# Altium schematic sheet Sheet_1_2022-10-20.schdoc
size 436 x 212 mm
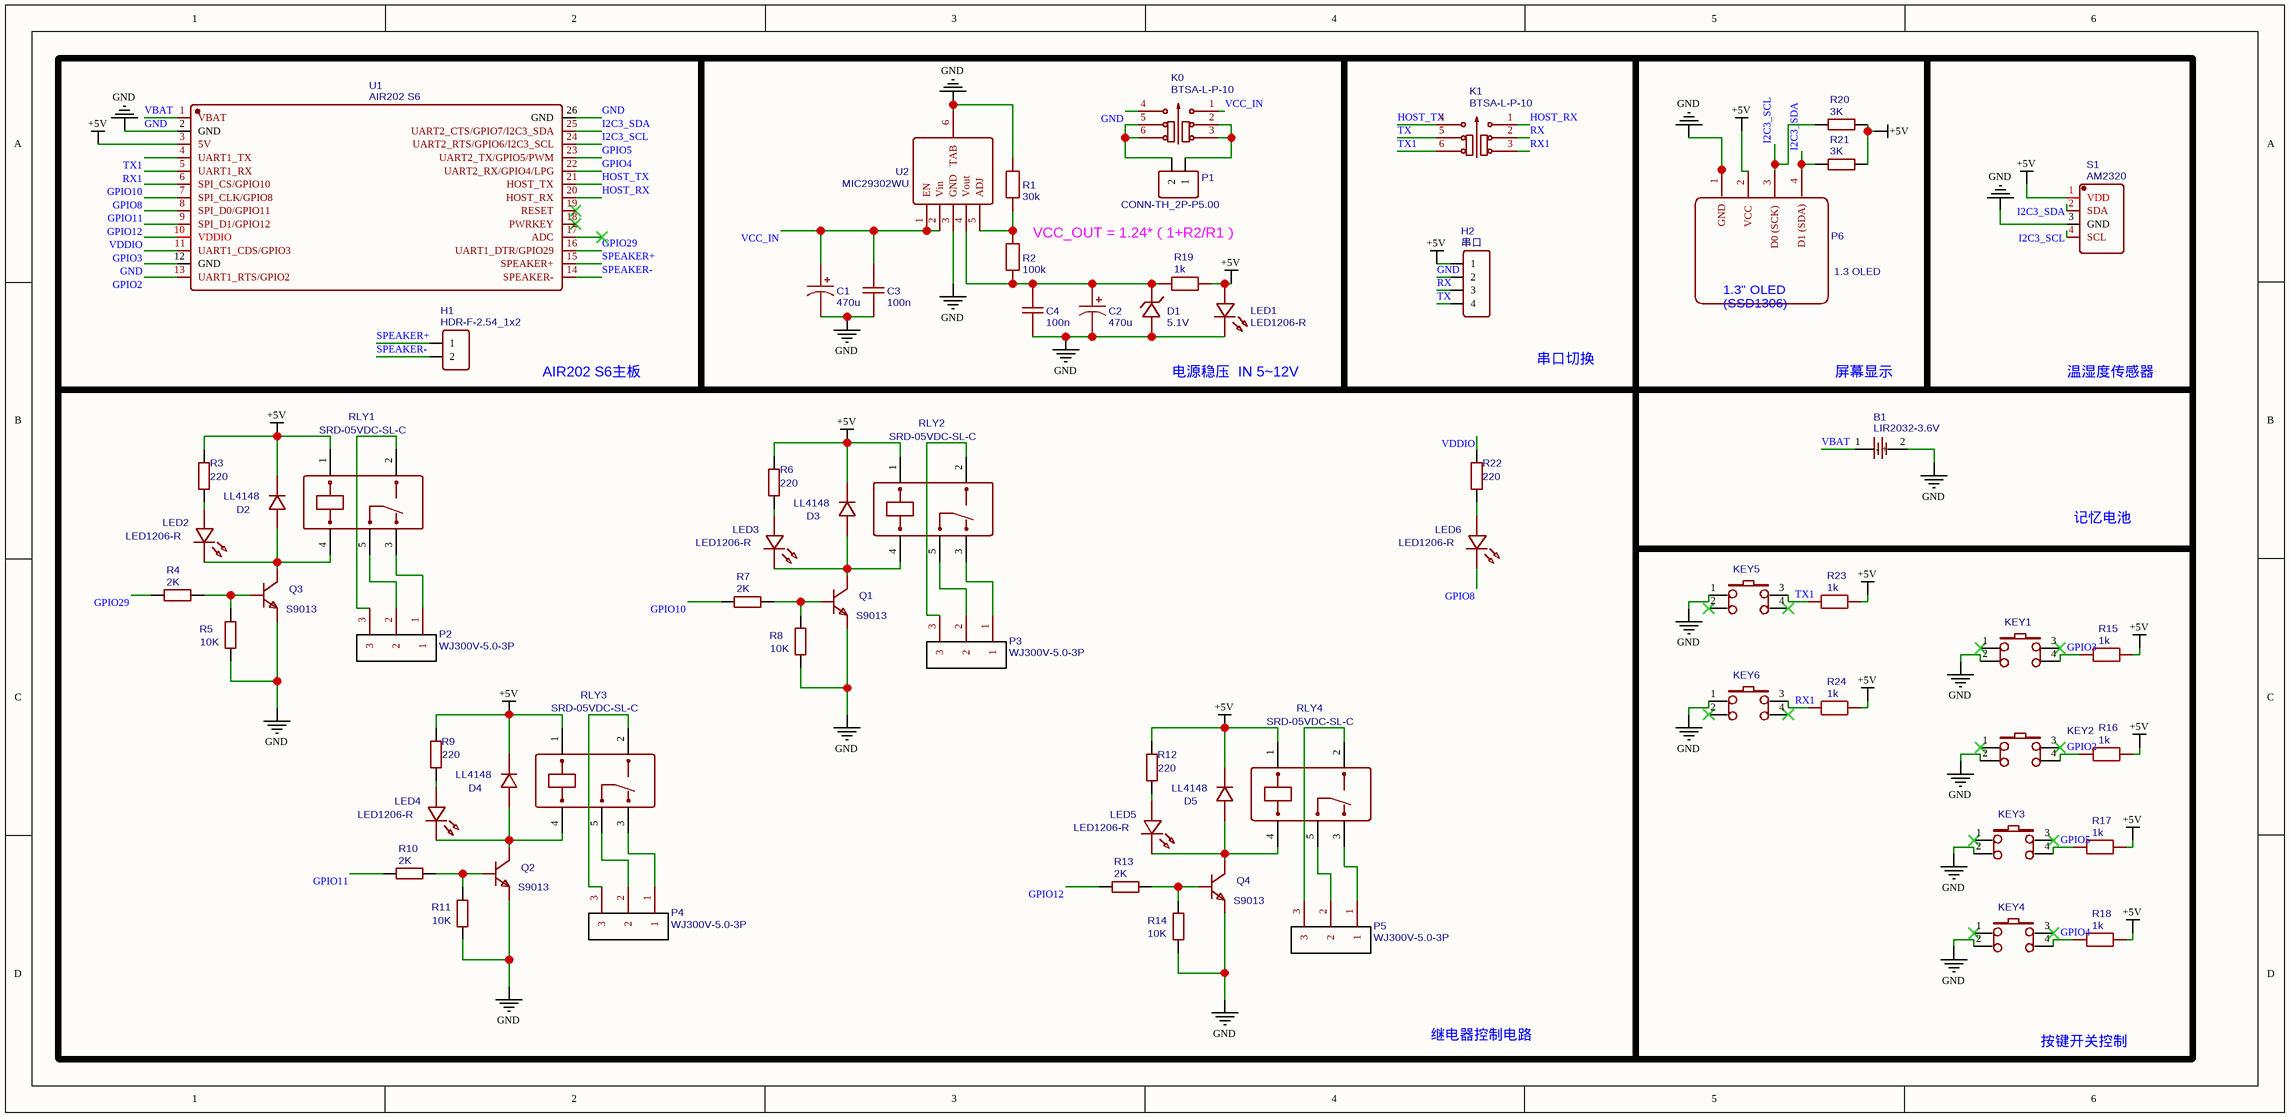
[diagram p0: Sheet_1_2022-10-20.schdoc]

## Parts
B1  LIR2032-3.6V  [LIR2032-3.6V]
C1  470u  [CAP-SMD_BD8.0-L8.3-W8.3-LS9.0-FD-A]
C2  470u  [CAP-SMD_BD8.0-L8.3-W8.3-LS9.0-FD-A]
C3  100n  [C0805]
C4  100n  [C0805]
D1  5.1V  [SMF_L2.8-W1.8-LS3.7-RD]
D2  LL4148  [LL-34_L3.5-W1.5-RD]
D3  LL4148  [LL-34_L3.5-W1.5-RD]
D4  LL4148  [LL-34_L3.5-W1.5-RD]
D5  LL4148  [LL-34_L3.5-W1.5-RD]
H1  HDR-F-2.54_1x2  [HDR-F-2.54_1X2]
H2  串口  [HDR-F-2.54_1X4]
K0  BTSA-L-P-10  [BTSA-L-P-10]
K1  BTSA-L-P-10  [BTSA-L-P-10]
KEY1  6x6x6Plastic head  [SW-SMD_4P-L6.0-W6.0-P4.50-LS8.6]  (value not drawn)
KEY2  6x6x6Plastic head  [SW-SMD_4P-L6.0-W6.0-P4.50-LS8.6]  (value not drawn)
KEY3  6x6x6Plastic head  [SW-SMD_4P-L6.0-W6.0-P4.50-LS8.6]  (value not drawn)
KEY4  6x6x6Plastic head  [SW-SMD_4P-L6.0-W6.0-P4.50-LS8.6]  (value not drawn)
KEY5  6x6x6Plastic head  [SW-SMD_4P-L6.0-W6.0-P4.50-LS8.6]  (value not drawn)
KEY6  6x6x6Plastic head  [SW-SMD_4P-L6.0-W6.0-P4.50-LS8.6]  (value not drawn)
LED1  LED1206-R  [LED1206-R-RD_RED]
LED2  LED1206-R  [LED1206-R-RD_RED]
LED3  LED1206-R  [LED1206-R-RD_RED]
LED4  LED1206-R  [LED1206-R-RD_RED]
LED5  LED1206-R  [LED1206-R-RD_RED]
LED6  LED1206-R  [LED1206-R-RD_RED]
P1  CONN-TH_2P-P5.00  [CONN-TH_2P-P5.00]
P2  WJ300V-5.0-3P  [CONN-TH_3P-P5.00_WJ300V-5.00-3P]
P3  WJ300V-5.0-3P  [CONN-TH_3P-P5.00_WJ300V-5.00-3P]
P4  WJ300V-5.0-3P  [CONN-TH_3P-P5.00_WJ300V-5.00-3P]
P5  WJ300V-5.0-3P  [CONN-TH_3P-P5.00_WJ300V-5.00-3P]
P6  1.3 OLED  [1.3 OLED SSD1306 4P]
Q1  S9013  [SOT-23-3_L2.9-W1.3-P1.90-LS2.4-BR]
Q2  S9013  [SOT-23-3_L2.9-W1.3-P1.90-LS2.4-BR]
Q3  S9013  [SOT-23-3_L2.9-W1.3-P1.90-LS2.4-BR]
Q4  S9013  [SOT-23-3_L2.9-W1.3-P1.90-LS2.4-BR]
R1  30k  [R1206]
R2  100k  [R1206]
R3  220  [R1206]
R4  2K  [R1206]
R5  10K  [R1206]
R6  220  [R1206]
R7  2K  [R1206]
R8  10K  [R1206]
R9  220  [R1206]
R10  2K  [R1206]
R11  10K  [R1206]
R12  220  [R1206]
R13  2K  [R1206]
R14  10K  [R1206]
R15  1k  [R1206]
R16  1k  [R1206]
R17  1k  [R1206]
R18  1k  [R1206]
R19  1k  [R1206]
R20  3K  [R1206]
R21  3K  [R1206]
R22  220  [R1206]
R23  1k  [R1206]
R24  1k  [R1206]
RLY1  SRD-05VDC-SL-C  [RELAY-TH_SRD-XXVDC-XL-C]
RLY2  SRD-05VDC-SL-C  [RELAY-TH_SRD-XXVDC-XL-C]
RLY3  SRD-05VDC-SL-C  [RELAY-TH_SRD-XXVDC-XL-C]
RLY4  SRD-05VDC-SL-C  [RELAY-TH_SRD-XXVDC-XL-C]
S1  AM2320  [SENSOR-TH_AM2320]
U1  AIR202 S6  [AIR202 S6]
U2  MIC29302WU  [TO-263-5_L10.2-W9.9-P1.70-LS14.4-TL]

## Blocks framed on the sheet
AIR202 S6主板: H1 U1
串口切换: H2 K1
屏幕显示: P6 R20 R21
温湿度传感器: S1
按键开关控制: KEY1-KEY6 R15-R18 R23 R24

## Nets
+5V: D2.1(C) D3.1(C) D4.1(C) D5.1(C) H2.1 LED1.1 P6.2(VCC) R3.2 R6.2 R9.2 R12.2 R15.2 R16.2 R17.2 R18.2 R19.2 R20.1 R21.1 R23.2 R24.2 RLY1.1 RLY2.1 RLY3.1 RLY4.1 S1.1(VDD) U1.3(5V)
GND: B1.2(-) C1.2 C2.2 C3.2 C4.2 D1.2(A) H2.2 K0.4 KEY1.2 KEY2.2 KEY3.2 KEY4.2 KEY5.1 KEY6.1 LED1.2 P6.1(GND) Q1.2(E) Q2.2(E) Q3.2(E) Q4.2(E) R1.1 R5.2 R8.2 R11.2 R14.2 S1.3(GND) U1.2(GND) U1.12(GND) U1.26(GND) U2.3(GND) U2.6(TAB)
GPIO2: KEY2.4 R16.1 U1.13(UART1_RTS/GPIO2)
GPIO3: KEY1.4 R15.1 U1.11(UART1_CDS/GPIO3)
GPIO4: KEY4.4 R18.1 U1.22(UART2_RX/GPIO4/LPG)
GPIO5: KEY3.4 R17.1 U1.23(UART2_TX/GPIO5/PWM)
GPIO8: LED6.2 U1.7(SPI_CLK/GPIO8)
GPIO10: R7.1 U1.6(SPI_CS/GPIO10)
GPIO11: R10.1 U1.8(SPI_D0/GPIO11)
GPIO12: R13.1 U1.9(SPI_D1/GPIO12)
GPIO29: R4.1 U1.16(UART1_DTR/GPIO29)
HOST_RX: K1.1 U1.20(HOST_RX)
HOST_TX: K1.4 U1.21(HOST_TX)
I2C3_SCL: P6.3(D0_(SCK)) R20.2 S1.4(SCL) U1.24(UART2_RTS/GPIO6/I2C3_SCL)
I2C3_SDA: P6.4(D1_(SDA)) R21.2 S1.2(SDA) U1.25(UART2_CTS/GPIO7/I2C3_SDA)
RX: H2.3 K1.2
RX1: K1.3 KEY6.3 R24.1 U1.5(UART1_RX)
SPEAKER+: H1.1 U1.15(SPEAKER+)
SPEAKER-: H1.2 U1.14(SPEAKER-)
TX: H2.4 K1.5
TX1: K1.6 KEY5.3 R23.1 U1.4(UART1_TX)
VBAT: B1.1(+) U1.1(VBAT)
VCC_IN: C1.1 C3.1 K0.1 U2.1(EN) U2.2(Vin)
VDDIO: R22.2 U1.10(VDDIO)
NetC2_1: C2.1 C4.1 D1.1(K) R2.2 R19.1 U2.4(Vout)
NetD2_2: D2.2(A) LED2.2 Q3.3(C) RLY1.4
NetD3_2: D3.2(A) LED3.2 Q1.3(C) RLY2.4
NetD4_2: D4.2(A) LED4.2 Q2.3(C) RLY3.4
NetD5_2: D5.2(A) LED5.2 Q4.3(C) RLY4.4
NetK0_2: K0.2 K0.3 P1.1
NetK0_5: K0.5 K0.6 P1.2
NetLED2_1: LED2.1 R3.1
NetLED3_1: LED3.1 R6.1
NetLED4_1: LED4.1 R9.1
NetLED5_1: LED5.1 R12.1
NetLED6_1: LED6.1 R22.1
NetP2_1: P2.1 RLY1.3
NetP2_2: P2.2 RLY1.5
NetP2_3: P2.3 RLY1.2
NetP3_1: P3.1 RLY2.3
NetP3_2: P3.2 RLY2.5
NetP3_3: P3.3 RLY2.2
NetP4_1: P4.1 RLY3.3
NetP4_2: P4.2 RLY3.5
NetP4_3: P4.3 RLY3.2
NetP5_1: P5.1 RLY4.3
NetP5_2: P5.2 RLY4.5
NetP5_3: P5.3 RLY4.2
NetQ1_1: Q1.1(B) R7.2 R8.1
NetQ2_1: Q2.1(B) R10.2 R11.1
NetQ3_1: Q3.1(B) R4.2 R5.1
NetQ4_1: Q4.1(B) R13.2 R14.1
NetR1_2: R1.2 R2.1 U2.5(ADJ)

Not connected (* = marked no-connect by the designer): KEY1 1* 3*; KEY2 1* 3*; KEY3 1* 3*; KEY4 1* 3*; KEY5 2* 4*; KEY6 2* 4*; U1 17(ADC)* 18(PWRKEY)* 19(RESET)*

## Notes on the sheet
- (near R2) VCC_OUT = 1.24*（1+R2/R1）
- 电源稳压  IN 5~12V
- 记忆电池
- 继电器控制电路
- (in symbol 1.3 OLED) 1.3" OLED / (SSD1306)

## Library data of the parts
B1 = LIR2032-3.6V: BOM_Manufacturer: Q&J; BOM_Manufacturer Part: CR2032-BS-6-1; Contributor: 壹科团队; BOM_Supplier: LCSC; image: //image.lceda.cn/szlcsc/C70377.jpg; BOM_Supplier Part: C70377; spicePre: B; spiceSymbolName: LIR2032-3.6V
C1 C2 = 470u: nameAlias: Value(F); Contributor: LCEDA_Lib; spicePre: C; spiceSymbolName: C_Tan_SMD_A_US
C3 C4 = 100n: nameAlias: Value(F); Contributor: LCEDA_Lib; spicePre: C; spiceSymbolName: C_0805_US
D1 = 5.1V: BOM_Manufacturer: VISHAY; BOM_Manufacturer Part: BZD27B75P-M3-08; Contributor: LCSC; BOM_Supplier: LCSC; BOM_Supplier Part: C145219; BOM_JLCPCB Part Class: Extended Part; spicePre: D; spiceSymbolName: BZD27B75P-M3-08
D2-D5 = LL4148: BOM_Manufacturer: STARSEA; BOM_Paste Type: expand; BOM_Supplier: LCSC; BOM_Manufacturer Part: LL4148; image: //image.lceda.cn/szlcsc/C84062.jpg; BOM_Supplier Part: C84062; spicePre: D; spiceSymbolName: LL4148-C84062
H1 = HDR-F-2.54_1x2: Contributor: LCEDA_Lib; BOM_Supplier Part: C49661; BOM_Supplier: LCSC; spicePre: H; spiceSymbolName: HDR-F-2.54_1x2
H2 = 串口: Contributor: LCEDA_Lib; BOM_Supplier Part: C225501; BOM_Supplier: LCSC; spicePre: H; spiceSymbolName: HDR-F-2.54_1x4
K0 K1 = BTSA-L-P-10: Contributor: qingsong03; spicePre: K; spiceSymbolName: BTSA-L-P-10
KEY1-KEY6 = 6x6x6Plastic head: BOM_Manufacturer: ReliaPro; BOM_Supplier Part: C23550; BOM_Supplier: LCSC; BOM_Manufacturer Part: 6x6x6Plastic head; BOM_JLCPCB Part Class: Extended Part; spicePre: K; spiceSymbolName: 6x6x6Plastic head
LED1-LED6 = LED1206-R: BOM_Manufacturer: EVERLIGHT(台湾亿光); BOM_Manufacturer Part: 19-217/R6C-AL1M2VY/3T; Contributor: LCEDA_01; BOM_Supplier Part: C72044; BOM_Supplier: LCSC; spicePre: L; spiceSymbolName: LED-0603_R
P1 = CONN-TH_2P-P5.00: Contributor: LCEDA_Lib; BOM_Supplier: LCSC; spicePre: P; spiceSymbolName: CONN-TH_2P-P5.00
P2-P5 = WJ300V-5.0-3P: BOM_Manufacturer: ReliaPro; BOM_Paste Type: expand; BOM_Supplier: LCSC; BOM_Manufacturer Part: WJ300V-5.0-3P; image: //image.lceda.cn/szlcsc/C8467.jpg; BOM_Supplier Part: C8467; spicePre: P; spiceSymbolName: WJ300V-5.0-3P
P6 = 1.3 OLED: sourceId: yK0HAabLc; timeStamp: 1472755794; BOM_Supplier: Brainy Bits; spicePre: P; spiceSymbolName: 1.3 OLED
Q1-Q4 = S9013: BOM_Manufacturer: WPMtek(维攀微); Contributor: LCSC; BOM_Supplier: LCSC; BOM_Supplier Part: C2688220; BOM_Manufacturer Part: S9013; spicePre: Q; spiceSymbolName: S9013
R1 = 30k: nameAlias: Value(Ω); Contributor: LCEDA_Lib; spicePre: R; spiceSymbolName: R_1206_EU
R2 = 100k: nameAlias: Value(Ω); Contributor: LCEDA_Lib; spicePre: R; spiceSymbolName: R_1206_EU
R3 R6 R9 R12 R22 = 220: BOM_Manufacturer: RALEC; BOM_Manufacturer Part: RTT06000JTP; nameAlias: Resistance (Ohms); BOM_Paste Type: expand; BOM_Assembly Type: smtWeld; BOM_Supplier: LCSC; BOM_Supplier Part: C104592; spicePre: R; spiceSymbolName: RTT06000JTP
R4 R7 R10 R13 = 2K: BOM_Manufacturer: RALEC; BOM_Manufacturer Part: RTT06000JTP; nameAlias: Resistance (Ohms); BOM_Paste Type: expand; BOM_Assembly Type: smtWeld; BOM_Supplier: LCSC; BOM_Supplier Part: C104592; spicePre: R; spiceSymbolName: RTT06000JTP
R5 R8 R11 R14 = 10K: BOM_Manufacturer: RALEC; BOM_Manufacturer Part: RTT06000JTP; nameAlias: Resistance (Ohms); BOM_Paste Type: expand; BOM_Assembly Type: smtWeld; BOM_Supplier: LCSC; BOM_Supplier Part: C104592; spicePre: R; spiceSymbolName: RTT06000JTP
R15-R19 R23 R24 = 1k: nameAlias: Value(Ω); Contributor: LCEDA_Lib; spicePre: R; spiceSymbolName: R_1206_EU
R20 R21 = 3K: BOM_Manufacturer: RALEC; BOM_Manufacturer Part: RTT06000JTP; nameAlias: Resistance (Ohms); BOM_Paste Type: expand; BOM_Assembly Type: smtWeld; BOM_Supplier: LCSC; BOM_Supplier Part: C104592; spicePre: R; spiceSymbolName: RTT06000JTP
RLY1-RLY4 = SRD-05VDC-SL-C: BOM_Manufacturer: SONGLE; BOM_Paste Type: expand; BOM_Supplier: LCSC; BOM_Manufacturer Part: SRD-05VDC-SL-C; image: //image.lceda.cn/szlcsc/C35449.jpg; BOM_Supplier Part: C35449; spicePre: R; spiceSymbolName: SRD-05VDC-SL-C
S1 = AM2320: BOM_Manufacturer: AOSONG; BOM_Supplier: LCSC; BOM_Manufacturer Part: AM2320; BOM_Supplier Part: C87932; spicePre: S; spiceSymbolName: AM2320
U1 = AIR202 S6: Contributor: liangen; spicePre: U; spiceSymbolName: AIR202 S6
U2 = MIC29302WU: BOM_Manufacturer: MICROCHIP; BOM_Supplier: LCSC; BOM_Manufacturer Part: MIC29302WU; BOM_Supplier Part: C11149; BOM_JLCPCB Part Class: Extended Part; spicePre: U; spiceSymbolName: MIC29302WU